# Altium project 2019_TFT_Strateasy.PrjPCB
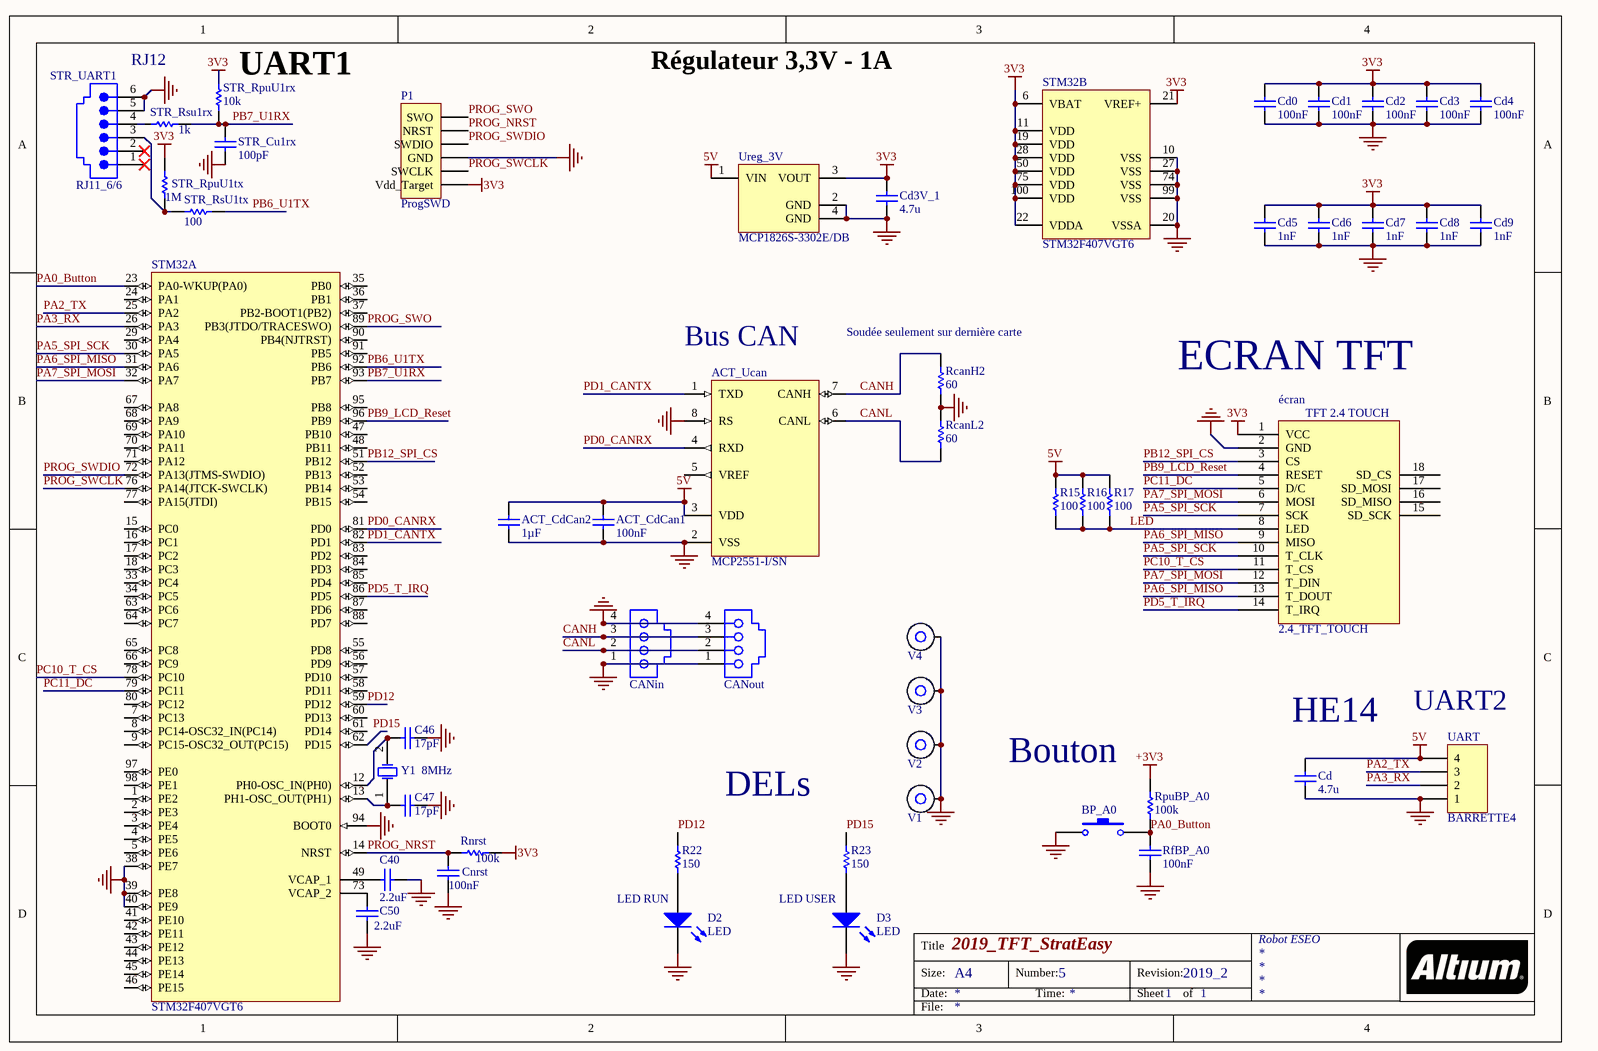
[diagram p0: 2019_TFT_Strateasy.SchDoc, left]
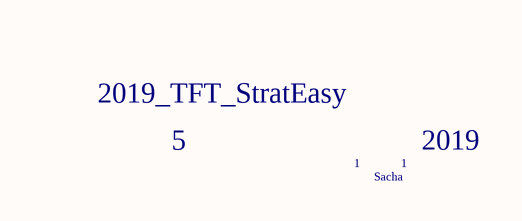
[diagram p1: 2019_TFT_Strateasy.SchDoc, right]
1 sheet, 51 parts. Net scope: global (net labels, ports and power ports of the same name join across sheets).
Board file: 2019_TFT_Strateasy.PCBDOC

## Sheet 2019_TFT_Strateasy.SchDoc: 2019_TFT_StratEasy
size A4; Date: 2018; CheckedBy: Sacha; Author: Sacha; CompanyName: Robot ESEO; DrawnBy: Sacha; Engineer: Sacha; Organization: Robot ESEO; DocumentNumber: 5; Revision: 2019_2; SheetNumber: 1; SheetTotal: 1

### Parts
ACT_CdCan1  100nF  [C0805_N]
ACT_CdCan2  1µF  [C0805_N]
ACT_Ucan  MCP2551-I/SN  [SO8_N]
BP_A0  SW_Pushbutton_6x6mm_Vertical  [Switch 6x6 Vertical]  (value not drawn)
C40  2.2uF  [C0805_N]
C46  17pF  [C0805_N]
C47  17pF  [C0805_N]
C50  2.2uF  [C0805_N]
CANin  634104149621  [634104149621]  (value not drawn)
CANout  634104149621  [634104149621]  (value not drawn)
Cd  4.7u  [C0805_N]
Cd0  100nF  [C0805_N]
Cd1  100nF  [C0805_N]
Cd2  100nF  [C0805_N]
Cd3  100nF  [C0805_N]
Cd3V_1  4.7u  [C0805_N]
Cd4  100nF  [C0805_N]
Cd5  1nF  [C0805_N]
Cd6  1nF  [C0805_N]
Cd7  1nF  [C0805_N]
Cd8  1nF  [C0805_N]
Cd9  1nF  [C0805_N]
Cnrst  100nF  [C0805_N]
D2  LED  [LED_0805]
D3  LED  [LED_0805]
P1  ProgSWD  [HDR1X6]
R15  100  [R1206_N]
R16  100  [R1206_N]
R17  100  [R1206_N]
R22  150  [R1206_N]
R23  150  [R1206_N]
RcanH2  60  [R1206_N]
RcanL2  60  [R1206_N]
RfBP_A0  100nF  [C0805_N]
Rnrst  100k  [R1206_N]
RpuBP_A0  100k  [R1206_N]
STM32  STM32F407VGT6  [STM-LQFP100_N]  (parts A,B of 2)
STR_Cu1rx  100pF  [C0805_N]
STR_RpuU1rx  10k  [R1206_N]
STR_RpuU1tx  1M  [R1206_N]
STR_Rsu1rx  1k  [R1206_N]
STR_RsU1tx  100  [R1206_N]
STR_UART1  RJ11_6/6  [RJ11_6/6 - Wurth Half Shielded Tab Down WR-MJ]
UART  BARRETTE4  [HE14_4]
Ureg_3V  MCP1826S-3302E/DB  [SOT223-4N]
V1  Entretoise WURTH CMS  [ENTRETOISE_CMS]  (value not drawn)
V2  Entretoise WURTH CMS  [ENTRETOISE_CMS]  (value not drawn)
V3  Entretoise WURTH CMS  [ENTRETOISE_CMS]  (value not drawn)
V4  Entretoise WURTH CMS  [ENTRETOISE_CMS]  (value not drawn)
Y1  8MHz  [HC49/4H_SMX]
écran  2.4_TFT_TOUCH  [2.4_TFT_TOUCH]

### Nets
3V3: Cd0.2 Cd1.2 Cd2.2 Cd3.2 Cd3V_1.2 Cd4.2 Cd5.2 Cd6.2 Cd7.2 Cd8.2 Cd9.2 P1.1(Vdd_Target) Rnrst.2 STM32.6(VBAT) STM32.11(VDD) STM32.19(VDD) STM32.21(VREF+) STM32.22(VDDA) STM32.28(VDD) STM32.50(VDD) STM32.75(VDD) STM32.100(VDD) STR_RpuU1rx.2 STR_RpuU1tx.2 Ureg_3V.3(VOUT) écran.1(VCC)
5V: ACT_CdCan1.2 ACT_CdCan2.2 ACT_Ucan.3(VDD) Cd.2 R15.2 R16.2 R17.2 UART.4 Ureg_3V.1(VIN)
+3V3: RpuBP_A0.1
GND: ACT_CdCan1.1 ACT_CdCan2.1 ACT_Ucan.2(VSS) ACT_Ucan.8(RS) BP_A0.1 C40.1 C46.1 C47.1 C50.1 CANin.1 CANin.4 CANout.1 CANout.4 Cd.1 Cd0.1 Cd1.1 Cd2.1 Cd3.1 Cd3V_1.1 Cd4.1 Cd5.1 Cd6.1 Cd7.1 Cd8.1 Cd9.1 Cnrst.1 D2.2(K) D3.2(K) P1.3(GND) RcanH2.2 RcanL2.2 RfBP_A0.1 STM32.10(VSS) STM32.20(VSSA) STM32.27(VSS) STM32.38(PE7) STM32.39(PE8) STM32.40(PE9) STM32.74(VSS) STM32.94(BOOT0) STM32.99(VSS) STR_Cu1rx.1 STR_UART1.5 STR_UART1.6 UART.1 Ureg_3V.2(GND) Ureg_3V.4(GND) V1.1 V2.1 V3.1 V4.1 écran.2(GND)
CANH: ACT_Ucan.7(CANH) CANin.3 CANout.3 RcanH2.1
CANL: ACT_Ucan.6(CANL) CANin.2 CANout.2 RcanL2.1
LED: R15.1 R16.1 R17.1 écran.8(LED)
PA0_Button: BP_A0.3 RfBP_A0.2 RpuBP_A0.2 STM32.23(PA0-WKUP(PA0))
PA2_TX: STM32.25(PA2) UART.3
PA3_RX: STM32.26(PA3) UART.2
PA5_SPI_SCK: STM32.30(PA5) écran.7(SCK) écran.10(T_CLK)
PA6_SPI_MISO: STM32.31(PA6) écran.9(MISO) écran.13(T_DOUT)
PA7_SPI_MOSI: STM32.32(PA7) écran.6(MOSI) écran.12(T_DIN)
PB6_U1TX: STM32.92(PB6) STR_RsU1tx.2
PB7_U1RX: STM32.93(PB7) STR_Cu1rx.2 STR_RpuU1rx.1 STR_Rsu1rx.1
PB9_LCD_Reset: STM32.96(PB9) écran.4(RESET)
PB12_SPI_CS: STM32.51(PB12) écran.3(CS)
PC10_T_CS: STM32.78(PC10) écran.11(T_CS)
PC11_DC: STM32.79(PC11) écran.5(D/C)
PD0_CANRX: ACT_Ucan.4(RXD) STM32.81(PD0)
PD1_CANTX: ACT_Ucan.1(TXD) STM32.82(PD1)
PD5_T_IRQ: STM32.86(PD5) écran.14(T_IRQ)
PD12: R22.2 STM32.59(PD12)
PD15: R23.2 STM32.62(PD15)
PROG_NRST: Cnrst.2 P1.5(NRST) Rnrst.1 STM32.14(NRST)
PROG_SWCLK: P1.2(SWCLK) STM32.76(PA14(JTCK-SWCLK))
PROG_SWDIO: P1.4(SWDIO) STM32.72(PA13(JTMS-SWDIO))
PROG_SWO: P1.6(SWO) STM32.89(PB3(JTDO/TRACESWO))
NetC40_2: C40.2 STM32.49(VCAP_1)
NetC46_2: C46.2 STM32.12(PH0-OSC_IN(PH0)) Y1.2(OSC2)
NetC47_2: C47.2 STM32.13(PH1-OSC_OUT(PH1)) Y1.1(OSC1)
NetC50_2: C50.2 STM32.73(VCAP_2)
NetD2_1: D2.1(A) R22.1
NetD3_1: D3.1(A) R23.1
NetSTR_RpuU1tx_1: STR_RpuU1tx.1 STR_RsU1tx.1 STR_UART1.3
NetSTR_Rsu1rx_2: STR_Rsu1rx.2 STR_UART1.4

Not connected (* = marked no-connect by the designer): ACT_Ucan 5(VREF); STM32 1(PE2) 2(PE3) 3(PE4) 4(PE5) 5(PE6) 7(PC13) 8(PC14-OSC32_IN(PC14)) 9(PC15-OSC32_OUT(PC15)) 15(PC0) 16(PC1) 17(PC2) 18(PC3) 24(PA1) 29(PA4) 33(PC4) 34(PC5) 35(PB0) 36(PB1) 37(PB2-BOOT1(PB2)) 41(PE10) 42(PE11) 43(PE12) 44(PE13) 45(PE14) 46(PE15) 47(PB10) 48(PB11) 52(PB13) 53(PB14) 54(PB15) 55(PD8) 56(PD9) 57(PD10) 58(PD11) 60(PD13) 61(PD14) 63(PC6) 64(PC7) 65(PC8) 66(PC9) 67(PA8) 68(PA9) 69(PA10) 70(PA11) 71(PA12) 77(PA15(JTDI)) 80(PC12) 83(PD2) 84(PD3) 85(PD4) 87(PD6) 88(PD7) 90(PB4(NJTRST)) 91(PB5) 95(PB8) 97(PE0) 98(PE1); STR_UART1 1* 2*; écran 15(SD_SCK) 16(SD_MISO) 17(SD_MOSI) 18(SD_CS)

### Notes on the sheet
- (near STR_UART1) RJ12
- (near STR_RpuU1rx) UART1
- Régulateur 3,3V - 1A
- (near ACT_Ucan) Bus CAN
- (near RcanH2) Soudée seulement sur dernière carte
- ECRAN TFT
- (near Cd) HE14
- (near UART) UART2
- DELs
- Bouton
- LED RUN
- LED USER
- 2019_TFT_StratEasy
- 5
- 1
- 2019
- Sacha
- Title
- Size:
- Date:
- A4
- Number:
- Time:
- Revision:
- Sheet
- of
- File:
- (in symbol 2.4_TFT_TOUCH) TFT 2.4 TOUCH

### Library data of the parts
ACT_CdCan1 ACT_CdCan2 C40 C46 C47 C50 Cd Cd0-Cd9 Cnrst RfBP_A0 STR_Cu1rx = Condensateur: Capacitor; Published: 8-Jun-2000; LatestRevisionDate: 17-Jul-2002; LatestRevisionNote: Re-released for DXP Platform.; PackageReference: RAD-0.3; Publisher: Altium Limited
ACT_Ucan = MCP2551-I/SN: High-Speed CAN Transceiver, 8-Pin SOIC, Industrial Temperature; Published: 25/11/09; DatasheetVersion: revE, Jan-2007; PackageVersion: revAW, Oct-2008; PackageReference: SOIC-SN8; Publisher: Damien Guitton; PackageDescription: 8-Lead Plastic Small Outline (SN) - Narrow, 3.90mm Body [SOIC]; Code_JEDEC: MS-012; Code_IPC: SOIC127P600-8; ComponentLink1Description: Manufacturer Link; ComponentLink1URL: http://www.microchip.com; ComponentLink2Description: Datasheet; ComponentLink2URL: http://ww1.microchip.com/downloads/en/DeviceDoc/21667E.pdf; ComponentLink3Description: Packaging Specification; ComponentLink3URL: http://ww1.microchip.com/downloads/en/PackagingSpec/00049AW.pdf
BP_A0 = SW_Pushbutton_6x6mm_Vertical: Switch tactil 6mm x 6mm Vertical; Published: 27/11/09; PackageReference: 6mm X 6mm; Publisher: Damien Guitton
CANin CANout = 634104149621: Modular Jack SMT Vertical Plastic 4P4C Top Entry WR-MJ; Rated Current: 1.5 A; Working Voltage: 120 VAC; Withstanding Voltage: 1000 VAC; Port: 1x1; ComponentLink1Description: Manufacturer; ComponentLink1URL: http://www.we-online.de; ComponentLink2Description: Datasheet; ComponentLink2URL: http://katalog.we-online.com/em/datasheet/634104149621.pdf; Part Number: 634104149621; Published Date: September 2017; Publisher: Wurth Elektronik; Pin Number: 4P4C; Entrance: Vertical
Cd3V_1 = Capacitor: Published: 8-Jun-2000; LatestRevisionDate: 17-Jul-2002; LatestRevisionNote: Re-released for DXP Platform.; PackageReference: RAD-0.3; Publisher: Altium Limited
D2 D3 = LED: Typical LED; Published: 8-Jun-2000; LatestRevisionDate: 08-Jul-2005; LatestRevisionNote: Mech Layer 1 removed.; PackageReference: LED-1; Publisher: Altium Limited
P1 = Header 6: Header, 6-Pin; LatestRevisionDate: 17-Jul-2002; LatestRevisionNote: Re-released for DXP Platform.; Publisher: Altium Limited
R15-R17 R22 R23 RcanH2 RcanL2 Rnrst RpuBP_A0 STR_RpuU1rx STR_RpuU1tx STR_Rsu1rx STR_RsU1tx = Resistor: Published: 8-Jun-2000; LatestRevisionDate: 17-Jul-2002; LatestRevisionNote: Re-released for DXP Platform.; PackageReference: AXIAL-0.5; Publisher: Altium Limited
STM32 = STM32F407VGT6: ARM Cortex-M4 32-bit MCU+FPU, 210 DMIPS, 1024 kB Flash, 192 kB Internal RAM, 82 I/Os, 100-pin LQFP, -40 to 85 degC, Tray; Manufacturer: STMicroelectronics; D/A Converter: 2x12-bit; FLASH Size (Prog) (kB): 1024; I/Os (High Current): 82; Internal RAM Size (kB): 192; Operating Frequency(F) (Processor speed) (MHz): 168; Supply Voltage(Vcc) max (V): 3.6; Supply Voltage(Vcc) min (V): 1.8; DatasheetVersion: Rev. 4; PackageVersion: Rev. 1, 06/2013; PackageReference: LQFP100; PackageDescription: 100-Pin Low Profile Quad Flat Package, 14 x 14 mm Body, 0.5 mm Pitch; Supplier 1: Digi-Key; Supplier Part Number 1: 497-11605-ND; Supplier 2: Farnell; Supplier Part Number 2: 2064368; Supplier 3: Newark; Supplier Part Number 3: 73T2333; Supplier 4: Mouser; Supplier Part Number 4: 511-STM32F407VGT6; Core: ARM Cortex-M4; Packing: Tray; Mounting Technology: Surface Mount; PartNumber: STM32F407VGT6; ComponentLink1Description: Manufacturer URL; ComponentLink1URL: http://www.st.com/web/en/home.html; ComponentLink2Description: Datasheet; ComponentLink2URL: http://www.st.com/st-web-ui/static/active/en/resource/technical/document/datasheet/DM00037051.pdf; ComponentLink3Description: Package Specification; ComponentLink3URL: http://www.st.com/st-web-ui/static/active/en/resource/technical/document/data_brief/DM00071938.pdf
STR_UART1 = RJ11_6/6: Right Angle, Standard Profile, Offset Latch DECconnect, Flangeless PCB Jack; Ports: 1; Positions/Loaded: Port1 - 6 Offset Latch/6; PerformanceCategory: 3; PCB_Mounting: Thru-Hole; DrillSize: Nominal, Rounded to nearest 0.05mm; PCB_Layout: Complies with Manufacturer's Recommendation.; Published: 25-Jun-2002; DatasheetDocument: 18-Dec-2001; PackageDocument: 18-Dec-2001; PackageReference: 15-43-6110; Publisher: Altium Limited; ComponentLink1Description: Manufacturer Link; ComponentLink1URL: http://www.molex.com/; ComponentLink2Description: Datasheet; ComponentLink2URL: http://www.molex.com/cmc_upload/common_files/1212003_41369catalogpage.pdf; Type: RJ11_6/6
UART = BARRETTE4: Header, 4-Pin; LatestRevisionDate: 17-Jul-2002; LatestRevisionNote: Re-released for DXP Platform.; Publisher: Altium Limited
Ureg_3V = MCP1826S-3302E/DB: 1000 mA, Low Voltage, Low Quiescent Current LDO Regulator, 3-Pin SOT-223, Extended Temperature; FirstPublished: 29-Jan-2009; DatasheetVersion: revA, Aug-2007; PackageVersion: revBB, Aug-2009; PackageReference: SOT-223-DB3; Publisher: Altium Limited; PackageDescription: 3-Lead Plastic Small Outline Transistor (DB) [SOT-223]; Supplier 1: Digi-Key; Supplier Part Number 1: MCP1826S-3302E/DB-ND; Supplier 2: Farnell; Supplier Part Number 2: 1578424; Supplier 3: Newark; Supplier Part Number 3: 27M0037; ComponentLink1Description: Datasheet; ComponentLink1URL: http://ww1.microchip.com/downloads/en/DeviceDoc/22057a.pdf; ComponentLink2Description: Packaging Specification; ComponentLink2URL: http://www.microchip.com/stellent/groups/techpub_sg/documents/packagingspec/en012702.pdf; ComponentLink3Description: Microchip.com Home; ComponentLink3URL: http://www.microchip.com/
V1-V4 = Entretoise WURTH CMS: Entretoise Wurth; Publisher: Damien Guitton
Y1 = Quartz: Crystal Oscillator; Published: 8-Jun-2000; LatestRevisionDate: 17-Jul-2002; LatestRevisionNote: Re-released for DXP Platform.; PackageReference: R38; Publisher: Altium Limited